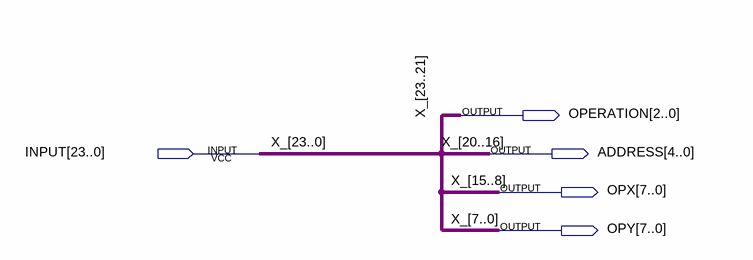
[diagram p0: schematic sheet]
// Quartus schematic Decoder.bdf as structural Verilog: 0 symbols, 5 pins
module Decoder (
  input  [23:0] INPUT,
  output [2:0] OPERATION,
  output [4:0] ADDRESS,
  output [7:0] OPX,
  output [7:0] OPY
);


  assign ADDRESS = INPUT[20:16];
  assign OPERATION = INPUT[23:21];
  assign OPX = INPUT[15:8];
  assign OPY = INPUT[7:0];

  // Other names for the same wires on the sheet: X_[23:0] = INPUT
endmodule
